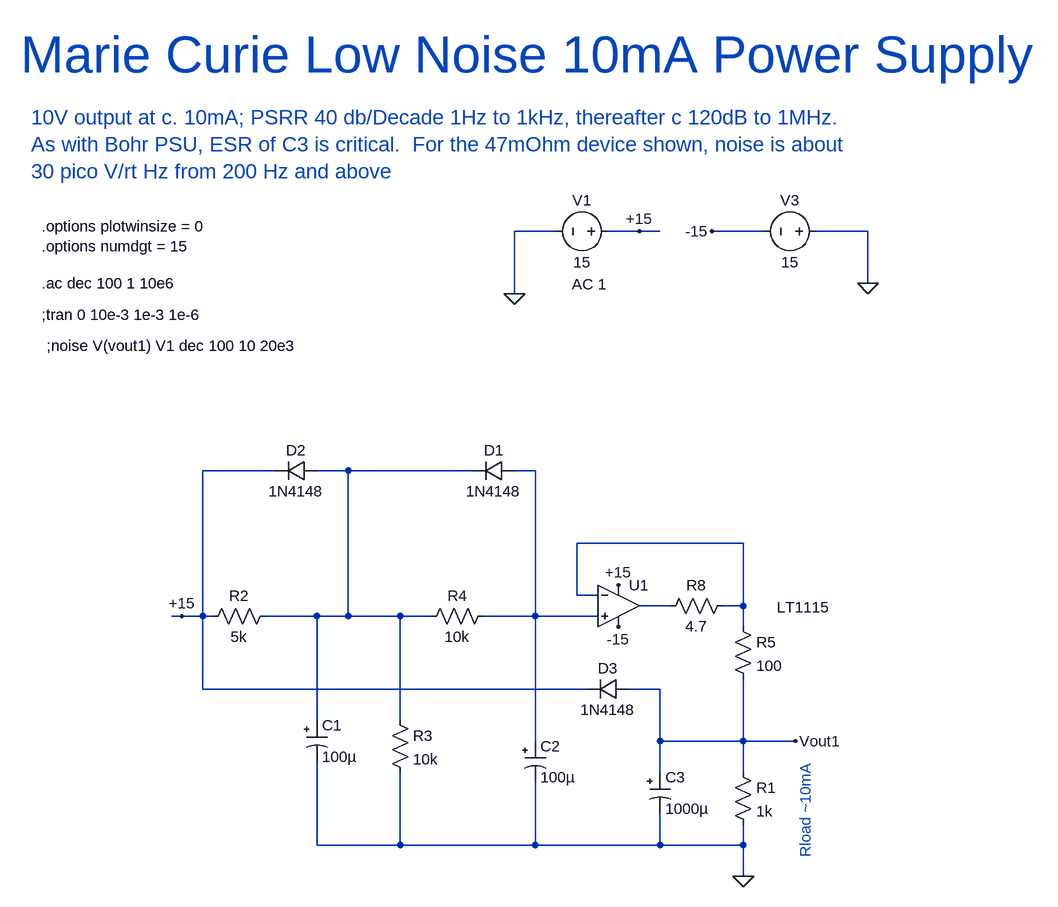
[diagram p0: schematic Marie_Curie.asc]
Marie_Curie.asc, the LTspice schematic file:
Version 4
SHEET 1 2724 680
WIRE 144 -576 80 -576
WIRE 272 -576 224 -576
WIRE 304 -576 272 -576
WIRE 464 -576 384 -576
WIRE 624 -576 544 -576
WIRE 624 -496 624 -576
WIRE 80 -480 80 -576
WIRE -288 -208 -400 -208
WIRE -176 -208 -224 -208
WIRE 16 -208 -176 -208
WIRE 112 -208 80 -208
WIRE 432 -96 176 -96
WIRE 176 -16 176 -96
WIRE 208 -16 176 -16
WIRE 320 0 272 0
WIRE 432 0 432 -96
WIRE 432 0 400 0
WIRE -432 16 -448 16
WIRE -400 16 -400 -208
WIRE -400 16 -432 16
WIRE -384 16 -400 16
WIRE -224 16 -304 16
WIRE -176 16 -176 -208
WIRE -176 16 -224 16
WIRE -96 16 -176 16
WIRE -48 16 -96 16
WIRE 112 16 112 -208
WIRE 112 16 32 16
WIRE 208 16 112 16
WIRE 432 32 432 0
WIRE -400 128 -400 16
WIRE 192 128 -400 128
WIRE 304 128 256 128
WIRE -224 176 -224 16
WIRE -96 176 -96 16
WIRE 112 208 112 16
WIRE 304 208 304 128
WIRE 432 208 432 112
WIRE 432 208 304 208
WIRE 512 208 432 208
WIRE 304 256 304 208
WIRE 432 256 432 208
WIRE -224 368 -224 240
WIRE -96 368 -96 256
WIRE -96 368 -224 368
WIRE 112 368 112 272
WIRE 112 368 -96 368
WIRE 304 368 304 320
WIRE 304 368 112 368
WIRE 432 368 432 336
WIRE 432 368 304 368
WIRE 432 416 432 368
FLAG 80 -480 0
FLAG 624 -496 0
FLAG 272 -576 +15
FLAG 240 -32 +15
FLAG 384 -576 -15
FLAG 240 32 -15
FLAG 512 208 Vout1
FLAG 432 416 0
FLAG -432 16 +15
SYMBOL voltage 240 -576 R90
WINDOW 0 -32 56 VBottom 2
WINDOW 3 32 56 VTop 2
WINDOW 123 97 45 VBottom 2
WINDOW 39 0 0 Left 2
SYMATTR InstName V1
SYMATTR Value 15
SYMATTR Value2 AC 1
SYMBOL Opamps\\LT1115 240 -64 R0
WINDOW 3 244 66 Left 2
SYMATTR InstName U1
SYMBOL voltage 560 -576 R90
WINDOW 0 -32 56 VBottom 2
WINDOW 3 32 56 VTop 2
WINDOW 123 2 56 VBottom 2
WINDOW 39 0 0 Left 2
SYMATTR InstName V3
SYMATTR Value 15
SYMBOL res 416 240 R0
SYMATTR InstName R1
SYMATTR Value 1k
SYMBOL res -288 0 R90
WINDOW 0 0 56 VBottom 2
WINDOW 3 32 56 VTop 2
SYMATTR InstName R2
SYMATTR Value 5k
SYMBOL res -112 160 R0
SYMATTR InstName R3
SYMATTR Value 10k
SYMBOL res 48 0 R90
WINDOW 0 0 56 VBottom 2
WINDOW 3 32 56 VTop 2
SYMATTR InstName R4
SYMATTR Value 10k
SYMBOL polcap 96 208 R0
WINDOW 3 24 56 Left 2
SYMATTR Value 100µ
SYMATTR InstName C2
SYMATTR Description Capacitor
SYMATTR Type cap
SYMATTR SpiceLine V=16 Irms=135m Rser=0.8 Lser=0 mfg="Nichicon" pn="UPR1C101MPH" type="Al electrolytic"
SYMBOL polcap -240 176 R0
WINDOW 3 24 56 Left 2
SYMATTR Value 100µ
SYMATTR InstName C1
SYMATTR Description Capacitor
SYMATTR Type cap
SYMATTR SpiceLine V=16 Irms=135m Rser=0.8 Lser=0 mfg="Nichicon" pn="UPR1C101MPH" type="Al electrolytic"
SYMBOL res 416 16 R0
SYMATTR InstName R5
SYMATTR Value 100
SYMBOL polcap 288 256 R0
WINDOW 3 24 56 Left 2
SYMATTR Value 1000µ
SYMATTR InstName C3
SYMATTR Description Capacitor
SYMATTR Type cap
SYMATTR SpiceLine V=16 Irms=1.41 Rser=0.047 Lser=0 mfg="Nichicon" pn="UPL1C102MPH" type="Al electrolytic"
SYMBOL res 416 -16 R90
WINDOW 0 0 56 VBottom 2
WINDOW 3 32 56 VTop 2
SYMATTR InstName R8
SYMATTR Value 4.7
SYMBOL diode 80 -224 R90
WINDOW 0 0 32 VBottom 2
WINDOW 3 32 32 VTop 2
SYMATTR InstName D1
SYMATTR Value 1N4148
SYMBOL diode -224 -224 R90
WINDOW 0 0 32 VBottom 2
WINDOW 3 32 32 VTop 2
SYMATTR InstName D2
SYMATTR Value 1N4148
SYMBOL diode 256 112 R90
WINDOW 0 0 32 VBottom 2
WINDOW 3 32 32 VTop 2
SYMATTR InstName D3
SYMATTR Value 1N4148
TEXT -648 -496 Left 2 !.ac dec 100 1 10e6
TEXT -648 -448 Left 2 !;tran 0 10e-3 1e-3 1e-6
TEXT -640 -400 Left 2 !;noise V(vout1) V1 dec 100 10 20e3
TEXT -648 -584 Left 2 !.options plotwinsize = 0\n.options numdgt = 15
TEXT -680 -848 Left 6 ;Marie Curie Low Noise 10mA Power Supply
TEXT -664 -752 Left 3 ;10V output at c. 10mA; PSRR 40 db/Decade 1Hz to 1kHz, thereafter c 120dB to 1MHz.\nAs with Bohr PSU, ESR of C3 is critical.  For the 47mOhm device shown, noise is about\n30 pico V/rt Hz from 200 Hz and above
TEXT 528 240 VRight 2 ;Rload ~10mA

The netlist it stands for:
* Marie_Curie.asc
V1 +15 0 15 AC 1
XU1 N002 N003 +15 -15 N004 LT1028  ; LT1115, pins In+ In- V+ V- OUT
V3 0 -15 15
R1 Vout1 0 1k
R2 N001 +15 5k
R3 N001 0 10k
R4 N002 N001 10k
C2 N002 0 100µ V=16 Irms=135m Rser=0.8 Lser=0 mfg="Nichicon" pn="UPR1C101MPH" type="Al electrolytic"
C1 N001 0 100µ V=16 Irms=135m Rser=0.8 Lser=0 mfg="Nichicon" pn="UPR1C101MPH" type="Al electrolytic"
R5 N003 Vout1 100
C3 Vout1 0 1000µ V=16 Irms=1.41 Rser=0.047 Lser=0 mfg="Nichicon" pn="UPL1C102MPH" type="Al electrolytic"
R8 N003 N004 4.7
D1 N002 N001 1N4148
D2 N001 +15 1N4148
D3 Vout1 +15 1N4148
.model D D
.lib standard.dio
.ac dec 100 1 10e6
;tran 0 10e-3 1e-3 1e-6
;noise V(vout1) V1 dec 100 10 20e3
.options plotwinsize = 0
.options numdgt = 15
* Marie Curie Low Noise 10mA Power Supply
* 10V output at c. 10mA; PSRR 40 db/Decade 1Hz to 1kHz, thereafter c 120dB to 1MHz.
* As with Bohr PSU, ESR of C3 is critical.  For the 47mOhm device shown, noise is about
* 30 pico V/rt Hz from 200 Hz and above
* Rload ~10mA
.lib LTC.lib
.backanno
.end